# Altium project stc89_pcb.PrjPcb
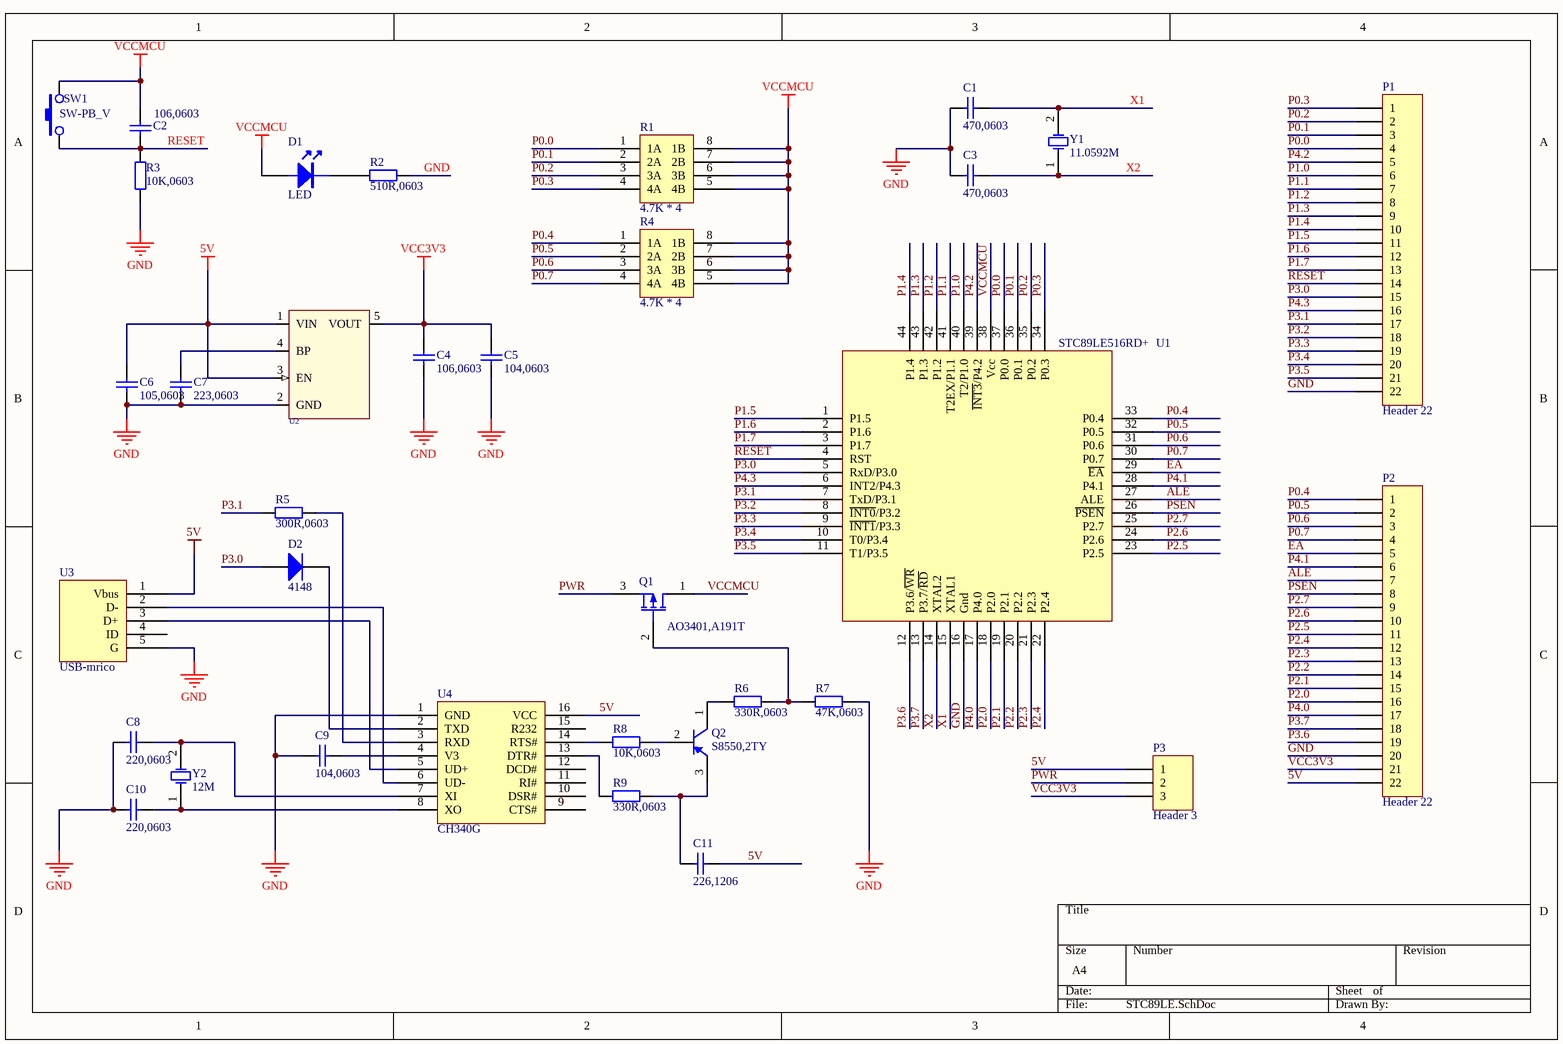
[diagram p0: STC89LE.SchDoc]
1 sheet, 34 parts. Net scope: global (net labels, ports and power ports of the same name join across sheets).
Board file: STC89LE.PcbDoc

## Sheet STC89LE.SchDoc
size A4

### Parts
C1  470,0603  [C 0603]
C2  106,0603  [C 0603]
C3  470,0603  [C 0603]
C4  106,0603  [C 0603]
C5  104,0603  [C 0603]
C6  105,0603  [C 0603]
C7  223,0603  [C 0603]
C8  220,0603  [C 0603]
C9  104,0603  [C 0603]
C10  220,0603  [C 0603]
C11  226,1206  [C 3216]
D1  LED  [LED 0805G]
D2  4148  [DSO-C2/G1.6]
P1  Header 22  [HDR1X22]
P2  Header 22  [HDR1X22]
P3  Header 3  [HDR1X3]
Q1  AO3401,A191T  [SOT23-3-MOS]
Q2  S8550,2TY  [SOT23-3-BJT]
R1  4.7K * 4  [8P4R 0603]
R2  510R,0603  [R 0603]
R3  10K,0603  [R 0603]
R4  4.7K * 4  [8P4R 0603]
R5  300R,0603  [R 0603]
R6  330R,0603  [R 0603]
R7  47K,0603  [R 0603]
R8  10K,0603  [R 0603]
R9  330R,0603  [R 0603]
SW1  SW-PB_V  [TSW SMD-3*6*2.5]
U1  STC89LE516RD+  [LQFP44]
U2  RT9193  [SOT23-5L]  (value not drawn)
U3  USB-mrico  [USB-micro_B]
U4  CH340G  [SOP16]
Y1  11.0592M  [XTAL-5032]
Y2  12M  [XTAL-5032]

### Nets
5V: C6.2 C11.1 P2.22 P3.1 U2.1(VIN) U2.3(EN) U3.1(Vbus) U4.16(VCC)
GND: C1.2 C3.2 C4.2 C5.1 C6.1 C7.1 C8.2 C9.2 C10.2 P1.22 P2.20 R2.2 R3.1 R7.1 U1.16(Gnd) U2.2(GND) U3.5(G) U4.1(GND)
VCC3V3: C4.1 C5.2 P2.21 P3.3 U2.5(VOUT)
VCCMCU: C2.2 D1.1 Q1.1(D) R1.5(4B) R1.6(3B) R1.7(2B) R1.8(1B) R4.5(4B) R4.6(3B) R4.7(2B) R4.8(1B) SW1.2 U1.38(Vcc)
ALE: P2.7 U1.27(ALE)
EA: P2.5 U1.29(~{EA})
P0.0: P1.4 R1.1(1A) U1.37(P0.0)
P0.1: P1.3 R1.2(2A) U1.36(P0.1)
P0.2: P1.2 R1.3(3A) U1.35(P0.2)
P0.3: P1.1 R1.4(4A) U1.34(P0.3)
P0.4: P2.1 R4.1(1A) U1.33(P0.4)
P0.5: P2.2 R4.2(2A) U1.32(P0.5)
P0.6: P2.3 R4.3(3A) U1.31(P0.6)
P0.7: P2.4 R4.4(4A) U1.30(P0.7)
P1.0: P1.6 U1.40(T2/P1.0)
P1.1: P1.7 U1.41(T2EX/P1.1)
P1.2: P1.8 U1.42(P1.2)
P1.3: P1.9 U1.43(P1.3)
P1.4: P1.10 U1.44(P1.4)
P1.5: P1.11 U1.1(P1.5)
P1.6: P1.12 U1.2(P1.6)
P1.7: P1.13 U1.3(P1.7)
P2.0: P2.16 U1.18(P2.0)
P2.1: P2.15 U1.19(P2.1)
P2.2: P2.14 U1.20(P2.2)
P2.3: P2.13 U1.21(P2.3)
P2.4: P2.12 U1.22(P2.4)
P2.5: P2.11 U1.23(P2.5)
P2.6: P2.10 U1.24(P2.6)
P2.7: P2.9 U1.25(P2.7)
P3.0: D2.1(A) P1.15 U1.5(RxD/P3.0)
P3.1: P1.17 R5.2 U1.7(TxD/P3.1)
P3.2: P1.18 U1.8(~{INT0}/P3.2)
P3.3: P1.19 U1.9(~{INT1}/P3.3)
P3.4: P1.20 U1.10(T0/P3.4)
P3.5: P1.21 U1.11(T1/P3.5)
P3.6: P2.19 U1.12(P3.6/~{WR})
P3.7: P2.18 U1.13(P3.7/~{RD})
P4.0: P2.17 U1.17(P4.0)
P4.1: P2.6 U1.28(P4.1)
P4.2: P1.5 U1.39(~{INT3}/P4.2)
P4.3: P1.16 U1.6(INT2/P4.3)
PSEN: P2.8 U1.26(~{PSEN})
PWR: P3.2 Q1.3(S)
RESET: C2.1 P1.14 R3.2 SW1.1 U1.4(RST)
X1: C1.1 U1.15(XTAL1) Y1.2(OSC2)
X2: C3.1 U1.14(XTAL2) Y1.1(OSC1)
NetC7_2: C7.2 U2.4(BP)
NetC8_1: C8.1 U4.7(XI) Y2.2(OSC2)
NetC9_1: C9.1 U4.4(V3)
NetC10_1: C10.1 U4.8(XO) Y2.1(OSC1)
NetC11_2: C11.2 Q2.3(E) R9.1
NetD1_2: D1.2 R2.1
NetD2_2: D2.2(K) U4.2(TXD)
NetQ1_2: Q1.2(G) R6.1 R7.2
NetQ2_1: Q2.1(C) R6.2
NetQ2_2: Q2.2(B) R8.1
NetR5_1: R5.1 U4.3(RXD)
NetR8_2: R8.2 U4.14(RTS#)
NetR9_2: R9.2 U4.13(DTR#)
NetU3_2: U3.2(D-) U4.6(UD-)
NetU3_3: U3.3(D+) U4.5(UD+)

Not connected (* = marked no-connect by the designer): U3 4(ID); U4 9(CTS#) 10(DSR#) 11(RI#) 12(DCD#) 15(R232)

### Library data of the parts
C1-C11 = Cap: Capacitor; Value: 104; Published: 8-Jun-2000; LatestRevisionDate: 17-Jul-2002; LatestRevisionNote: Re-released for DXP Platform.; Publisher: Altium Limited
D2 = Diode 1N4005: 1 Amp General Purpose Rectifier; Published: 8-Jun-2000; LatestRevisionDate: 17-Jul-2002; LatestRevisionNote: Re-released for DXP Platform.; DatasheetVersion: 1998; PackageVersion: Aug-1999; PackageReference: DO-41; Publisher: Altium Limited; PackageDescription: Diode, Axial; Body 5.2 x 2.7 mm (LxDia. max), Lead Dia. 0.86 mm (max); Code_JEDEC: DO-204-AL; ComponentLink1Description: Manufacturer Link; ComponentLink1URL: http://www.fairchildsemi.com/; ComponentLink2Description: Datasheet; ComponentLink2URL: http://www.fairchildsemi.com/ds/1N%2F1N4001.pdf
P1 P2 = Header 22: Header, 22-Pin; LatestRevisionDate: 17-Jul-2002; LatestRevisionNote: Re-released for DXP Platform.; Publisher: Altium Limited
P3 = Header 3: Header, 3-Pin; LatestRevisionDate: 17-Jul-2002; LatestRevisionNote: Re-released for DXP Platform.; Publisher: Altium Limited
Q1 = MOSFET-P: P-Channel MOSFET; Published: 8-Jun-2000; LatestRevisionDate: 17-Jul-2002; LatestRevisionNote: Re-released for DXP Platform.; PackageVersion: 1995/1996; PackageReference: E3; Publisher: Altium Limited; PackageDescription: TO, Flat Index; 3 In-Line, Axial Leads; Body Dia. 4.6mm; Lead Dia. 0.5 mm (max)
Q2 = PNP: PNP Bipolar Transistor; Published: 8-Jun-2000; LatestRevisionDate: 29-May-2009; LatestRevisionNote: IPC-7351 Footprint Added.; PackageVersion: Aug-1999; PackageReference: SOT-23B; Publisher: Altium Limited; PackageDescription: 3-Pin SOT-23 Package 0.95 mm Pitch, 2.4 mm Lead Span
R1 R4 = Res1
R2 R3 R5-R9 = Res2: Resistor; Published: 8-Jun-2000; LatestRevisionDate: 17-Jul-2002; LatestRevisionNote: Re-released for DXP Platform.; Publisher: Altium Limited
SW1 = SW-PB_V: SWITCH
U2 = RT9193X_5P: ICA_MFR_NAME: RICHTEK; ICA_PARTNUM: $$2191094$$RT9193-15CU5; Part Number: TMP-13
U3 = usb-STM
Y1 Y2 = XTAL: Crystal Oscillator; Published: 8-Jun-2000; LatestRevisionDate: 17-Jul-2002; LatestRevisionNote: Re-released for DXP Platform.; Publisher: Altium Limited